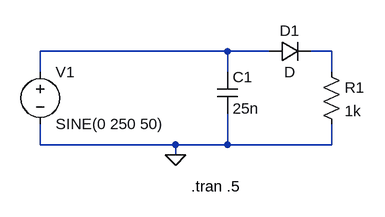
[diagram p0: schematic CA+Condo.asc]
CA+Condo.asc, the LTspice schematic file:
Version 4
SHEET 1 880 680
WIRE 256 112 -32 112
WIRE 320 112 256 112
WIRE 416 112 384 112
WIRE -32 144 -32 112
WIRE 256 144 256 112
WIRE 416 144 416 112
WIRE -32 256 -32 224
WIRE 176 256 -32 256
WIRE 256 256 256 208
WIRE 256 256 176 256
WIRE 416 256 416 224
WIRE 416 256 256 256
WIRE 176 272 176 256
FLAG 176 272 0
SYMBOL voltage -32 128 R0
WINDOW 123 0 0 Left 0
WINDOW 39 0 0 Left 0
SYMATTR InstName V1
SYMATTR Value SINE(0 250 50)
SYMBOL cap 240 144 R0
SYMATTR InstName C1
SYMATTR Value 25n
SYMBOL res 400 128 R0
SYMATTR InstName R1
SYMATTR Value 1k
SYMBOL diode 320 128 R270
WINDOW 0 32 32 VTop 2
WINDOW 3 0 32 VBottom 2
SYMATTR InstName D1
TEXT 200 320 Left 2 !.tran .5

The netlist it stands for:
* CA+Condo.asc
V1 N001 0 SINE(0 250 50)
C1 N001 0 25n
R1 N002 0 1k
D1 N001 N002 D
.model D D
.lib standard.dio
.tran .5
.backanno
.end